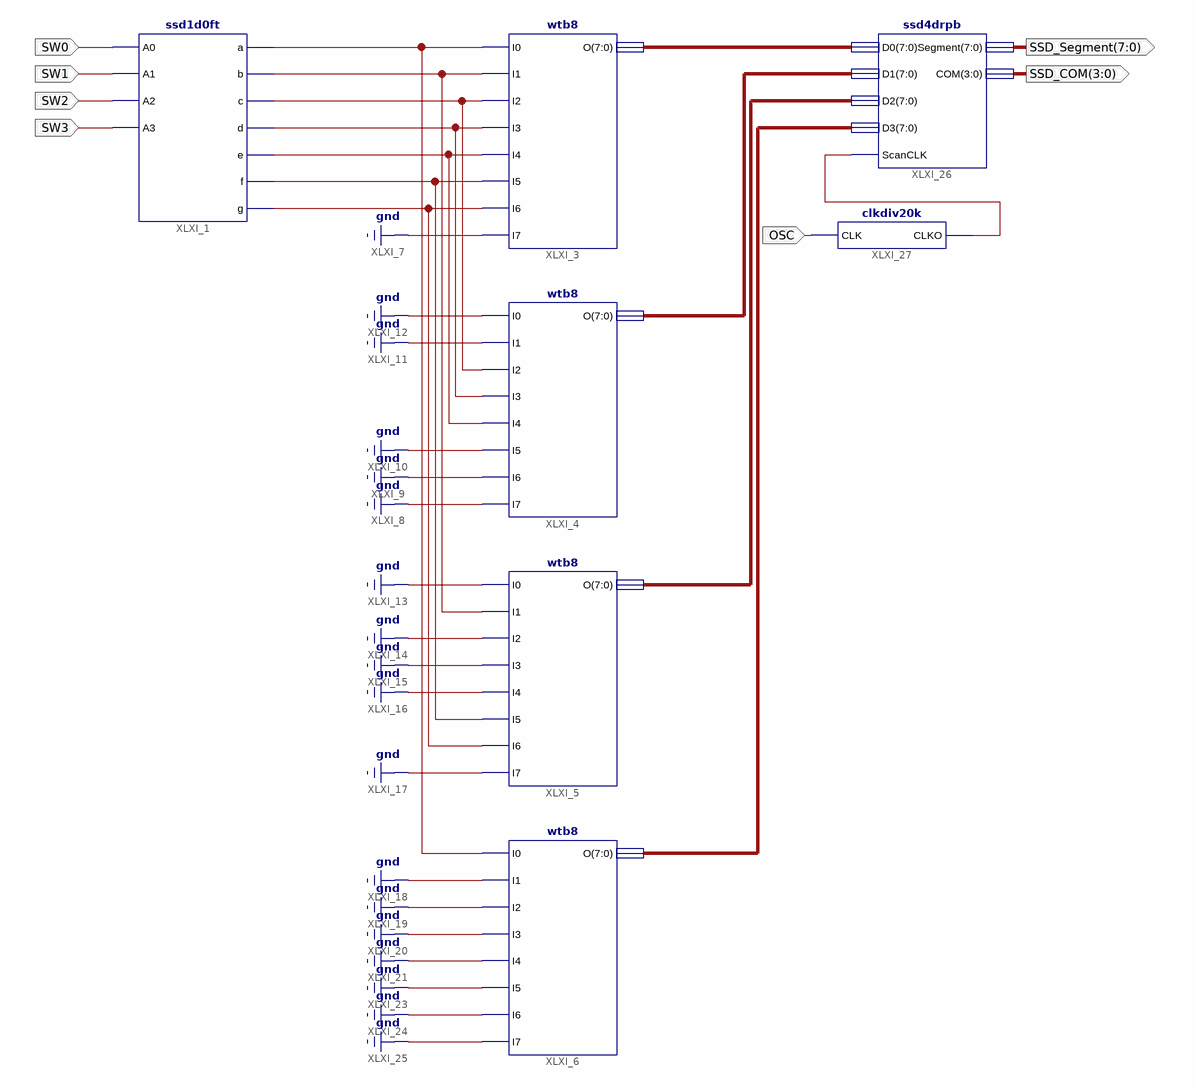
[diagram p0: schematic sheet 1]
// Xilinx ISE schematic main.sch (spartan6) as structural Verilog: 7 symbols, 7 ports
module main (
  input  SW0,
  input  SW1,
  input  SW2,
  input  SW3,
  input  OSC,
  output [3:0] SSD_COM,
  output [7:0] SSD_Segment
);

  wire XLXN_17, XLXN_18, XLXN_19, XLXN_20, XLXN_21, XLXN_22, XLXN_23, XLXN_52;
  wire [7:0] XLXN_43, XLXN_44, XLXN_45, XLXN_46;

  ssd1d0ft XLXI_1 (
    .a(XLXN_23), .A0(SW0), .A1(SW1), .A2(SW2), .A3(SW3), .b(XLXN_20), .c(XLXN_17), .d(XLXN_18), .e(XLXN_19),
    .f(XLXN_21), .g(XLXN_22));
  wtb8 XLXI_3 (
    .I0(XLXN_23), .I1(XLXN_20), .I2(XLXN_17), .I3(XLXN_18), .I4(XLXN_19), .I5(XLXN_21), .I6(XLXN_22),
    .I7(1'b0), .O(XLXN_43));
  wtb8 XLXI_4 (
    .I0(1'b0), .I1(1'b0), .I2(XLXN_17), .I3(XLXN_18), .I4(XLXN_19), .I5(1'b0), .I6(1'b0), .I7(1'b0),
    .O(XLXN_44));
  wtb8 XLXI_5 (
    .I0(1'b0), .I1(XLXN_20), .I2(1'b0), .I3(1'b0), .I4(1'b0), .I5(XLXN_21), .I6(XLXN_22), .I7(1'b0),
    .O(XLXN_45));
  wtb8 XLXI_6 (.I0(XLXN_23), .I1(1'b0), .I2(1'b0), .I3(1'b0), .I4(1'b0), .I5(1'b0), .I6(1'b0), .I7(1'b0), .O(XLXN_46));
  ssd4drpb XLXI_26 (
    .COM(SSD_COM), .D0(XLXN_43), .D1(XLXN_44), .D2(XLXN_45), .D3(XLXN_46), .ScanCLK(XLXN_52),
    .Segment(SSD_Segment));
  clkdiv20k XLXI_27 (.CLK(OSC), .CLKO(XLXN_52));
endmodule
